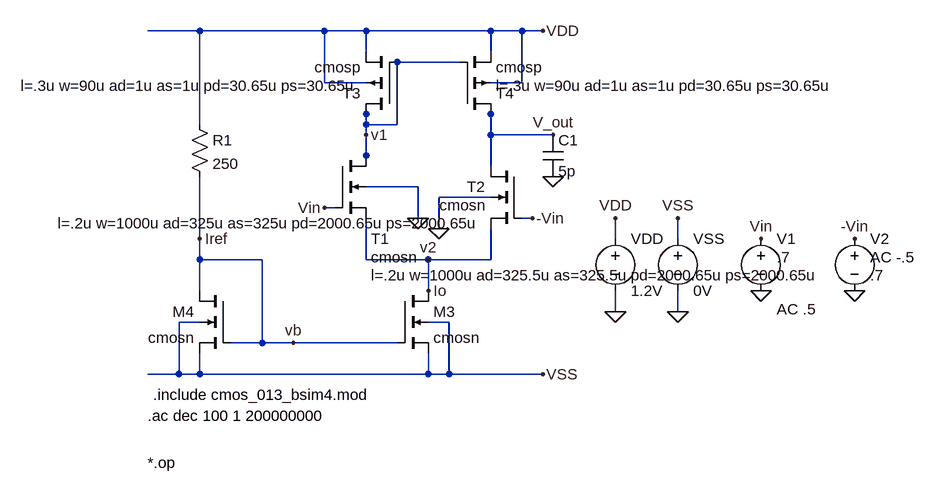
[diagram p0: schematic test1.asc]
test1.asc, the LTspice schematic file:
Version 4
SHEET 1 1452 736
WIRE 256 16 176 16
WIRE 448 16 256 16
WIRE 512 16 448 16
WIRE 704 16 512 16
WIRE 752 16 704 16
WIRE 784 16 752 16
WIRE 512 48 512 16
WIRE 704 48 704 16
WIRE 656 64 560 64
WIRE 448 96 448 16
WIRE 512 96 448 96
WIRE 752 96 752 16
WIRE 752 96 704 96
WIRE 512 144 512 128
WIRE 704 144 704 128
WIRE 256 160 256 16
WIRE 512 160 512 144
WIRE 560 160 560 64
WIRE 560 160 512 160
WIRE 512 176 512 160
WIRE 704 176 704 144
WIRE 800 176 704 176
WIRE 512 208 512 176
WIRE 512 224 512 208
WIRE 704 224 704 176
WIRE 592 256 512 256
WIRE 704 272 624 272
WIRE 464 288 448 288
WIRE 592 304 592 256
WIRE 768 304 752 304
WIRE 624 320 624 272
WIRE 256 336 256 240
WIRE 896 336 896 304
WIRE 992 336 992 304
WIRE 256 368 256 336
WIRE 352 368 256 368
WIRE 512 368 512 304
WIRE 608 368 512 368
WIRE 704 368 704 320
WIRE 704 368 608 368
WIRE 256 416 256 368
WIRE 608 416 608 368
WIRE 896 448 896 416
WIRE 992 448 992 416
WIRE 256 464 224 464
WIRE 640 464 608 464
WIRE 352 496 352 368
WIRE 352 496 304 496
WIRE 400 496 352 496
WIRE 560 496 400 496
WIRE 224 544 224 464
WIRE 224 544 176 544
WIRE 256 544 256 512
WIRE 256 544 224 544
WIRE 608 544 608 512
WIRE 608 544 256 544
WIRE 640 544 640 464
WIRE 640 544 608 544
WIRE 784 544 640 544
FLAG 784 16 VDD
FLAG 896 448 0
FLAG 896 304 VDD
FLAG 800 176 V_out
FLAG 784 544 VSS
FLAG 992 448 0
FLAG 992 304 VSS
FLAG 1120 416 0
FLAG 768 304 -Vin
FLAG 448 288 Vin
FLAG 1120 336 Vin
FLAG 1264 416 0
FLAG 1264 336 -Vin
FLAG 592 304 0
FLAG 624 320 0
FLAG 512 176 v1
FLAG 608 368 v2
FLAG 800 240 0
FLAG 400 496 vb
FLAG 256 336 Iref
FLAG 608 416 Io
SYMBOL nmos4 752 224 M0
WINDOW 3 56 60 Left 2
WINDOW 123 56 88 Left 2
SYMATTR Value cmosn
SYMATTR Value2 l=.2u w=1000u ad=325u as=325u pd=2000.65u ps=2000.65u
SYMATTR InstName T2
SYMBOL nmos4 464 208 R0
WINDOW 0 56 128 Left 2
WINDOW 3 56 156 Left 2
WINDOW 123 56 184 Left 2
SYMATTR InstName T1
SYMATTR Value cmosn
SYMATTR Value2 l=.2u w=1000u ad=325.5u as=325.5u pd=2000.65u ps=2000.65u
SYMBOL pmos4 656 144 M180
WINDOW 123 56 44 Left 2
SYMATTR Value2 l=.3u w=90u ad=1u as=1u pd=30.65u ps=30.65u
SYMATTR InstName T4
SYMATTR Value cmosp
SYMBOL pmos4 560 144 R180
WINDOW 123 56 44 Left 2
SYMATTR Value2 l=.3u w=90u ad=1u as=1u pd=30.65u ps=30.65u
SYMATTR InstName T3
SYMATTR Value cmosp
SYMBOL voltage 896 320 R0
SYMATTR InstName VDD
SYMATTR Value 1.2V
SYMBOL voltage 992 320 R0
SYMATTR InstName VSS
SYMATTR Value 0V
SYMBOL voltage 1120 320 R0
WINDOW 123 24 124 Left 2
WINDOW 39 0 0 Left 0
WINDOW 3 24 44 Left 2
SYMATTR Value2 AC .5
SYMATTR Value .7
SYMATTR InstName V1
SYMBOL voltage 1264 320 R0
WINDOW 123 24 44 Left 2
WINDOW 39 0 0 Left 0
WINDOW 3 24 72 Left 2
SYMATTR Value2 AC -.5
SYMATTR Value .7
SYMATTR InstName V2
SYMBOL cap 784 176 R0
SYMATTR InstName C1
SYMATTR Value 5p
SYMBOL nmos4 560 416 R0
SYMATTR InstName M3
SYMATTR Value cmosn
SYMATTR Value2 l=.13u w=3.55u ad=1.1538u as=1.1538u pd=4.2000u ps=4.2000u
SYMBOL nmos4 304 416 M0
SYMATTR InstName M4
SYMATTR Value cmosn
SYMATTR Value2 l=.2u w=.2253u ad=.0732u as=.0732u pd=0.8753u ps=0.8753u
SYMBOL res 240 144 R0
SYMATTR InstName R1
SYMATTR Value 250
TEXT 176 608 Left 2 !.ac dec 100 1 200000000
TEXT 184 576 Left 2 !.include cmos_013_bsim4.mod
TEXT 176 680 Left 2 !*.op

The netlist it stands for:
* test1.asc
M§T2 V_out -Vin Io 0 cmosn l=.2u w=1000u ad=325u as=325u pd=2000.65u ps=2000.65u
M§T1 v1 Vin Io 0 cmosn l=.2u w=1000u ad=325.5u as=325.5u pd=2000.65u ps=2000.65u
M§T4 V_out v1 VDD VDD cmosp l=.3u w=90u ad=1u as=1u pd=30.65u ps=30.65u
M§T3 v1 v1 VDD VDD cmosp l=.3u w=90u ad=1u as=1u pd=30.65u ps=30.65u
VDD VDD 0 1.2V
VSS VSS 0 0V
V1 Vin 0 .7 AC .5
V2 -Vin 0 .7 AC -.5
C1 V_out 0 5p
M3 Io Iref VSS VSS cmosn l=.13u w=3.55u ad=1.1538u as=1.1538u pd=4.2000u ps=4.2000u
M4 Iref Iref VSS VSS cmosn l=.2u w=.2253u ad=.0732u as=.0732u pd=0.8753u ps=0.8753u
R1 VDD Iref 250
.model NMOS NMOS
.model PMOS PMOS
.lib standard.mos
.ac dec 100 1 200000000
.include cmos_013_bsim4.mod
*.op
.backanno
.end